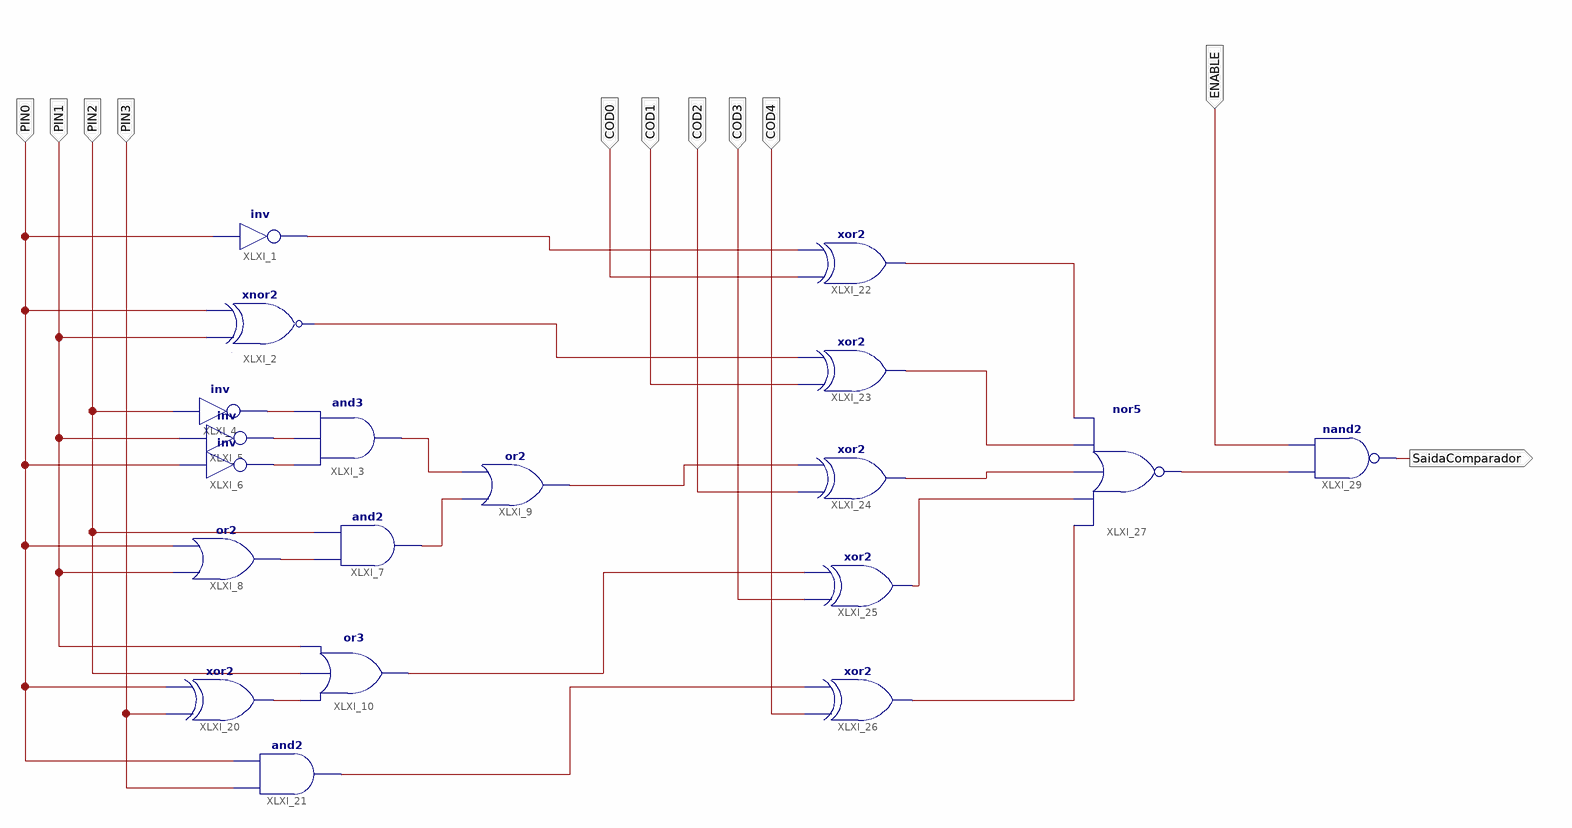
[diagram p0: schematic sheet 1]
// Xilinx ISE schematic Comparador.sch (spartan3e) as structural Verilog: 19 symbols, 11 ports
module Comparador (
  input  PIN0,
  input  PIN1,
  input  PIN2,
  input  PIN3,
  input  COD0,
  input  COD1,
  input  COD2,
  input  COD3,
  input  COD4,
  input  ENABLE,
  output SaidaComparador
);

  wire EXTCOMPARATOR, XLXN_5, XLXN_6, XLXN_7, XLXN_8, XLXN_9, XLXN_10, XLXN_11, XLXN_12, XLXN_13, XLXN_14,
       XLXN_16, XLXN_17, XLXN_30, XLXN_31, XLXN_32, XLXN_33, XLXN_34;

  not XLXI_1 (XLXN_30, PIN0);
  xnor XLXI_2 (XLXN_31, PIN1, PIN0);
  and XLXI_3 (XLXN_9, XLXN_7, XLXN_6, XLXN_5);
  not XLXI_4 (XLXN_5, PIN2);
  not XLXI_5 (XLXN_6, PIN1);
  not XLXI_6 (XLXN_7, PIN0);
  and XLXI_7 (XLXN_10, XLXN_8, PIN2);
  or XLXI_8 (XLXN_8, PIN1, PIN0);
  or XLXI_9 (XLXN_32, XLXN_10, XLXN_9);
  or XLXI_10 (XLXN_33, XLXN_11, PIN2, PIN1);
  xor XLXI_20 (XLXN_11, PIN3, PIN0);
  and XLXI_21 (XLXN_34, PIN3, PIN0);
  xor XLXI_22 (XLXN_12, COD0, XLXN_30);
  xor XLXI_23 (XLXN_13, COD1, XLXN_31);
  xor XLXI_24 (XLXN_14, COD2, XLXN_32);
  xor XLXI_25 (XLXN_16, COD3, XLXN_33);
  xor XLXI_26 (XLXN_17, COD4, XLXN_34);
  nor XLXI_27 (EXTCOMPARATOR, XLXN_17, XLXN_16, XLXN_14, XLXN_13, XLXN_12);
  nand XLXI_29 (SaidaComparador, EXTCOMPARATOR, ENABLE);
endmodule
